# Altium project CLK.PrjPcb
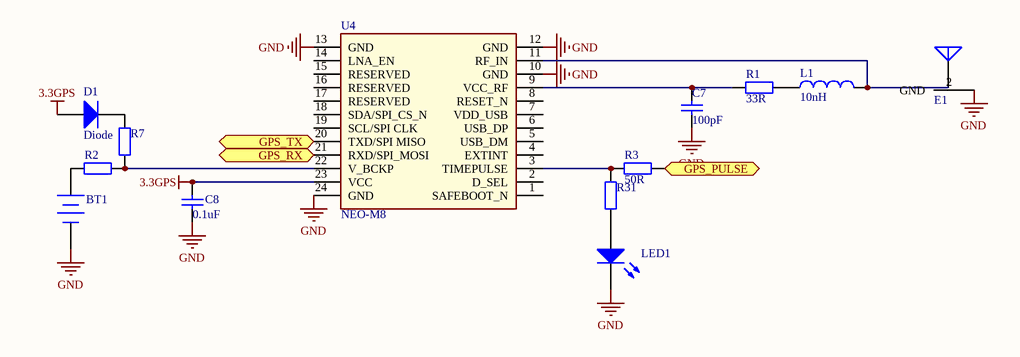
[diagram p0: GPS.SchDoc]
4 sheets, 120 parts. Net scope: flat (ports and power ports of the same name join across sheets).
Board file: CLK.PcbDoc
Sheets:
  GPS.SchDoc
  power.SchDoc
  mcu.SchDoc
  PLL1.SchDoc

## Sheet GPS.SchDoc
size A4

### Parts
BT1  Battery  [XH414H-IV01E]  (value not drawn)
C7  100pF  [0402]
C8  0.1uF  [0402]
D1  Diode  [LC-SOD-323]
E1  Antenna  [IPEX]  (value not drawn)
L1  10nH  [0402]
LED1  LED0  [0603]  (value not drawn)
R1  33R  [0402]
R2  (no value)  [0402]
R3  50R  [0402]
R7  (no value)  [0402]
R31  (no value)  [0402]
U4  NEO-M8  [NEO]

### Ports
GPS_PULSE, GPS_RX, GPS_TX

### Nets
3.3GPS: C8.2 D1.1(A) U4.23(VCC)
GND: BT1.2(-) C7.1 C8.1 E1.2(GND) LED1.2(K) U4.10(GND) U4.12(GND) U4.13(GND) U4.24(GND)
NetBT1_1: BT1.1(+) R2.1
NetC7_2: C7.2 R1.1 U4.9(VCC_RF)
NetC19_1: R3.1 ; port GPS_PULSE
NetD1_2: D1.2(K) R7.1
NetE1_1: E1.1(ANT) L1.2 U4.11(RF_IN)
NetL1_1: L1.1 R1.2
NetLED1_1: LED1.1(A) R31.2
NetR2_2: R2.2 R7.2 U4.22(V_BCKP)
NetR3_2: R3.2 R31.1 U4.3(TIMEPULSE)
NetU2_30: U4.20(TXD/SPI_MISO) ; port GPS_TX
NetU2_31: U4.21(RXD/SPI_MOSI) ; port GPS_RX

Not connected (* = marked no-connect by the designer): U4 1(SAFEBOOT_N) 2(D_SEL) 4(EXTINT) 5(USB_DM) 6(USB_DP) 7(VDD_USB) 8(RESET_N) 14(LNA_EN) 15(RESERVED) 16(RESERVED) 17(RESERVED) 18(SDA/SPI_CS_N) 19(SCL/SPI_CLK)

### Library data of the parts
BT1 = Battery: Multicell Battery; Published: 24-Mar-1999; LatestRevisionDate: 17-Jul-2002; LatestRevisionNote: Re-released for DXP Platform.; PackageReference: BAT-2; Publisher: Altium Limited; PackageDescription: Battery; 2 Leads
C7 C8 = Cap: Capacitor; Published: 8-Jun-2000; LatestRevisionDate: 17-Jul-2002; LatestRevisionNote: Re-released for DXP Platform.; PackageReference: RAD-0.3; Publisher: Altium Limited; PackageDescription: Radial Cap, Thru-Hole; 2 Leads; 0.3 in Pin Spacing
D1 = Diode: Default Diode; Published: 8-Jun-2000; LatestRevisionDate: 17-Jul-2002; LatestRevisionNote: Re-released for DXP Platform.; PackageVersion: Sep-1996; PackageReference: SMC; Publisher: Altium Limited; PackageDescription: DO-214-AB/SMC; 2 C-Bend Leads; Body 7.9 x 5.9 mm, inc. leads (LxW); Code_JEDEC: DO-214-AB
E1 = Antenna: Generic Antenna; Published: 24-Mar-1999; LatestRevisionDate: 17-Jul-2002; LatestRevisionNote: Re-released for DXP Platform.; PackageReference: PIN1; Publisher: Altium Limited
L1 = Inductor: Code_IEC: 1005; Value: 10mH; Published: 8-Jun-2000; LatestRevisionDate: 29-May-2009; LatestRevisionNote: IPC-7351 Footprint Added.; PackageReference: 0402-A; Publisher: Altium Limited; PackageDescription: Chip Inductor; Code_JEITA: 0402
LED1 = LED0: Typical INFRARED GaAs LED; Published: 8-Jun-2000; LatestRevisionDate: 08-Jul-2005; LatestRevisionNote: Mech Layer 1 removed.; PackageReference: LED-0; Publisher: Altium Limited; PackageDescription: LED; 2 Leads
R1 R3 = Res2: Resistor; Published: 8-Jun-2000; LatestRevisionDate: 17-Jul-2002; LatestRevisionNote: Re-released for DXP Platform.; PackageReference: AXIAL-0.4; Publisher: Altium Limited; PackageDescription: Axial Device, Thru-Hole; 2 Leads; 0.4 in Pin Spacing
R2 R7 R31 = Res2: Resistor; Value: 0R; Published: 8-Jun-2000; LatestRevisionDate: 17-Jul-2002; LatestRevisionNote: Re-released for DXP Platform.; PackageReference: AXIAL-0.4; Publisher: Altium Limited; PackageDescription: Axial Device, Thru-Hole; 2 Leads; 0.4 in Pin Spacing
U4 = NEO: u-blox NEO GNSS module; Part Description: u-blox GNSS module; Manufacturer: u-blox; Value: NEO-M8

## Sheet power.SchDoc
size A4
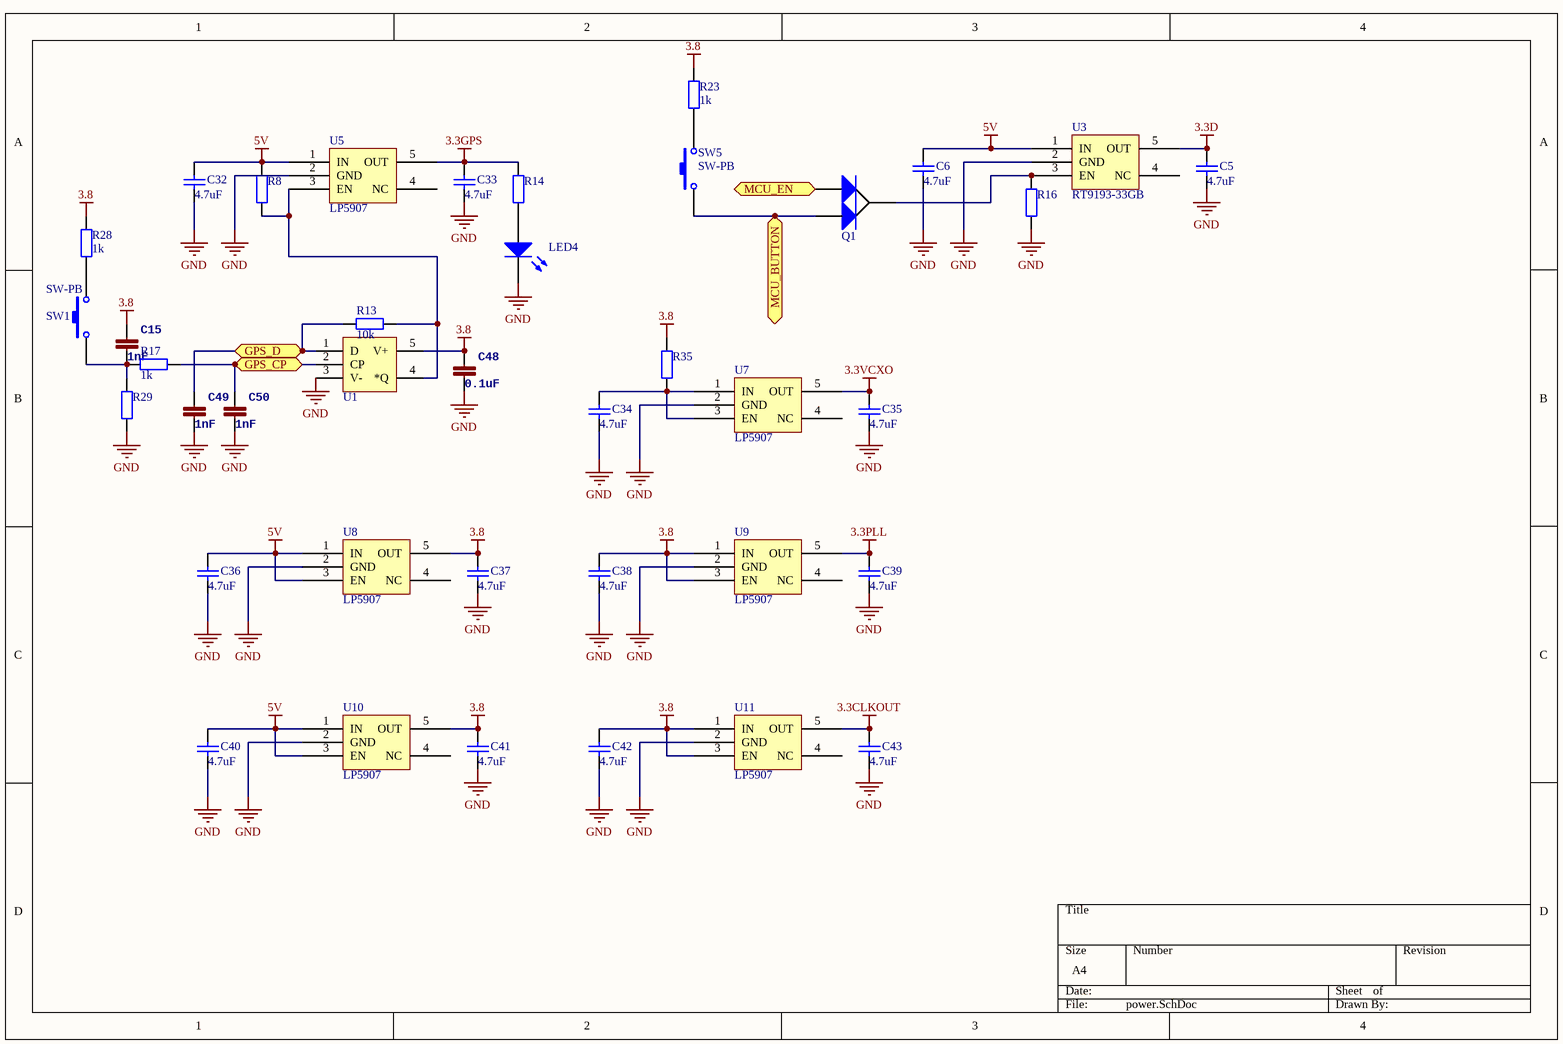
[diagram p1: power.SchDoc]

### Parts
C5  4.7uF  [0603L]
C6  4.7uF  [0603L]
C15  1nF  [0402]
C32  4.7uF  [0603L]
C33  4.7uF  [0603L]
C34  4.7uF  [0603L]
C35  4.7uF  [0603L]
C36  4.7uF  [0603L]
C37  4.7uF  [0603L]
C38  4.7uF  [0603L]
C39  4.7uF  [0603L]
C40  4.7uF  [0603L]
C41  4.7uF  [0603L]
C42  4.7uF  [0603L]
C43  4.7uF  [0603L]
C48  0.1uF  [0402]
C49  1nF  [0402]
C50  1nF  [0402]
LED4  LED0  [0603L]  (value not drawn)
Q1  BAT54C  [SOT-23B_L]  (value not drawn)
R8  (no value)  [0402]
R13  10k  [0402]
R14  (no value)  [0402]
R16  (no value)  [0402]
R17  1k  [0402]
R23  1k  [0402]
R28  1k  [0402]
R29  (no value)  [0402]
R35  (no value)  [0603L]
SW1  SW-PB  [SW3x4]
SW5  SW-PB  [SW3x4]
U1  74-1G80  [SOT23-5]  (value not drawn)
U3  RT9193-33GB  [SOT23-5]
U5  LP5907  [SOT23-5]
U7  LP5907  [SOT23-5]
U8  LP5907  [SOT23-5]
U9  LP5907  [SOT23-5]
U10  LP5907  [SOT23-5]
U11  LP5907  [SOT23-5]

### Ports
GPS_CP, GPS_D, MCU_BUTTON, MCU_EN

### Nets
3.3CLKOUT: C43.2 U11.5(OUT)
3.3D: C5.2 U3.5(OUT)
3.3GPS: C33.2 R14.1 U5.5(OUT)
3.3PLL: C39.2 U9.5(OUT)
3.3VCXO: C35.2 U7.5(OUT)
3.8: C15.1 C37.2 C38.2 C41.2 C42.2 C48.1 R23.2 R28.2 R35.1 U1.5(V+) U8.5(OUT) U9.1(IN) U9.3(EN) U10.5(OUT) U11.1(IN) U11.3(EN)
5V: C6.2 C32.2 C36.2 C40.2 R8.1 U3.1(IN) U5.1(IN) U8.1(IN) U8.3(EN) U10.1(IN) U10.3(EN)
GND: C5.1 C6.1 C32.1 C33.1 C34.1 C35.1 C36.1 C37.1 C38.1 C39.1 C40.1 C41.1 C42.1 C43.1 C48.2 C49.2 C50.2 LED4.2(K) R16.2 R29.1 U1.3(V-) U3.2(GND) U5.2(GND) U7.2(GND) U8.2(GND) U9.2(GND) U10.2(GND) U11.2(GND)
NetC15_2: C15.2 R17.2 R29.2 SW1.1
NetC34_2: C34.2 R35.2 U7.1(IN) U7.3(EN)
NetC49_1: C49.1 R13.1 U1.1(D) ; port GPS_D
NetC50_1: C50.1 R17.1 U1.2(CP) ; port GPS_CP
NetLED4_1: LED4.1(A) R14.2
NetQ1_1: Q1.1(A) ; port MCU_EN
NetQ1_2: Q1.2(A) SW5.1 ; port MCU_BUTTON
NetQ1_3: Q1.3(K) R16.1 U3.3(EN)
NetR8_2: R8.2 R13.2 U1.4(*Q) U5.3(EN)
NetR23_1: R23.1 SW5.2
NetR28_1: R28.1 SW1.2

Not connected (* = marked no-connect by the designer): U3 4(NC); U5 4(NC); U7 4(NC); U8 4(NC); U9 4(NC); U10 4(NC); U11 4(NC)

### Library data of the parts
C5 C6 C32-C43 = Cap: Capacitor; Published: 8-Jun-2000; LatestRevisionDate: 17-Jul-2002; LatestRevisionNote: Re-released for DXP Platform.; PackageReference: RAD-0.3; Publisher: Altium Limited; PackageDescription: Radial Cap, Thru-Hole; 2 Leads; 0.3 in Pin Spacing
C15 C48-C50 = CAP0402-CAP: <b>Capacitor</b> / Standard 0603 ceramic capacitor, and 0.1" leaded capacitor.; PARTNO: CC0402ZRY5V7BB104
LED4 = LED0: Typical INFRARED GaAs LED; Published: 8-Jun-2000; LatestRevisionDate: 08-Jul-2005; LatestRevisionNote: Mech Layer 1 removed.; PackageReference: LED-0; Publisher: Altium Limited; PackageDescription: LED; 2 Leads
R8 R14 R16 R29 R35 = Res2: Resistor; Value: 0R; Published: 8-Jun-2000; LatestRevisionDate: 17-Jul-2002; LatestRevisionNote: Re-released for DXP Platform.; PackageReference: AXIAL-0.4; Publisher: Altium Limited; PackageDescription: Axial Device, Thru-Hole; 2 Leads; 0.4 in Pin Spacing
R13 = Res2: Resistor; Value: 47k; Published: 8-Jun-2000; LatestRevisionDate: 17-Jul-2002; LatestRevisionNote: Re-released for DXP Platform.; PackageReference: AXIAL-0.4; Publisher: Altium Limited; PackageDescription: Axial Device, Thru-Hole; 2 Leads; 0.4 in Pin Spacing
R17 = Res2: Resistor; Published: 8-Jun-2000; LatestRevisionDate: 17-Jul-2002; LatestRevisionNote: Re-released for DXP Platform.; PackageReference: AXIAL-0.4; Publisher: Altium Limited; PackageDescription: Axial Device, Thru-Hole; 2 Leads; 0.4 in Pin Spacing
R23 R28 = Res2: Resistor; Value: 0Ohm; Published: 8-Jun-2000; LatestRevisionDate: 17-Jul-2002; LatestRevisionNote: Re-released for DXP Platform.; PackageReference: AXIAL-0.4; Publisher: Altium Limited; PackageDescription: Axial Device, Thru-Hole; 2 Leads; 0.4 in Pin Spacing
SW1 SW5 = SW-PB: Switch; Published: 24-Mar-1999; LatestRevisionDate: 17-Jul-2002; LatestRevisionNote: Re-released for DXP Platform.; PackageReference: SPST-2; Publisher: Altium Limited; PackageDescription: Switch; 2 Leads
U3 = LP5907

## Sheet mcu.SchDoc
size A4
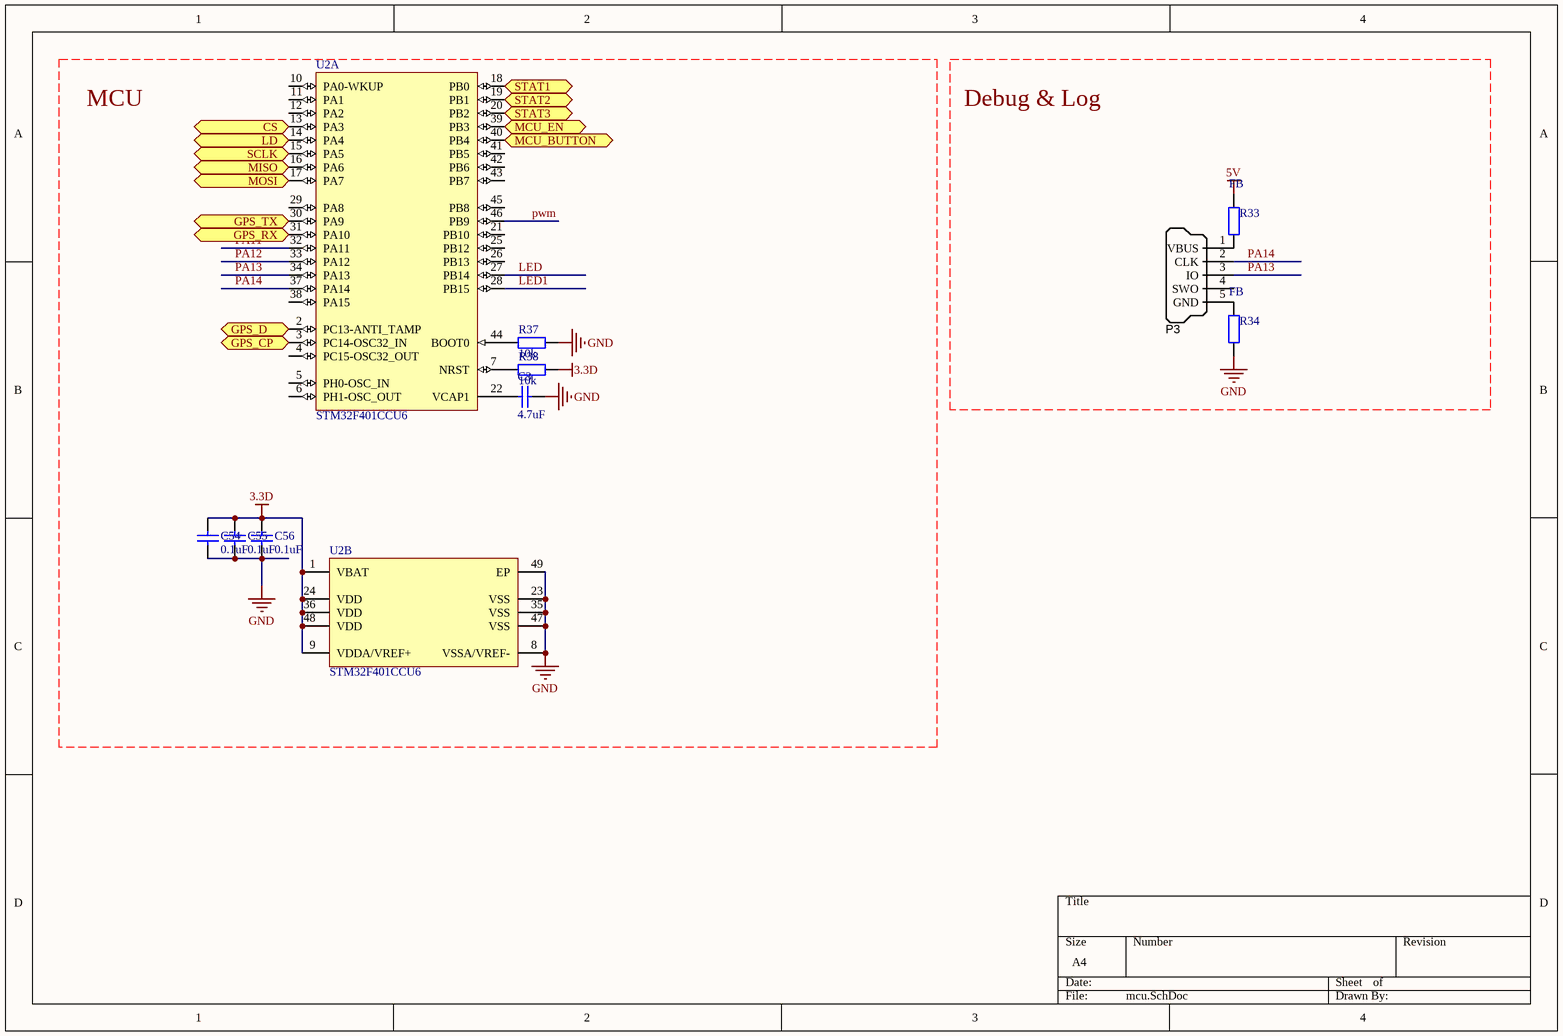
[diagram p2: mcu.SchDoc]

### Parts
C3  value 4.7uF  [0603]  (hidden comment: Cap)
C54  value 0.1uF  [0402]  (hidden comment: Cap)
C55  value 0.1uF  [0402]  (hidden comment: Cap)
C56  value 0.1uF  [0402]  (hidden comment: Cap)
P3  SWD_MicroUSB  [MICRO-YZX]  (value not drawn)
R33  FB  [0603L]
R34  FB  [0603L]
R37  value 10k  [0402]  (hidden comment: Res2)
R38  value 10k  [0402]  (hidden comment: Res2)
U2  STM32F401CCU6  [STM-UFQFPN48_N]  (parts A,B of 2)

### Ports
CS, GPS_CP, GPS_D, GPS_RX, GPS_TX, LD, MCU_BUTTON, MCU_EN, MISO, MOSI, SCLK, STAT1, STAT2, STAT3

### Nets
3.3D: C54.2 C55.2 C56.2 R38.1 U2.1(VBAT) U2.9(VDDA/VREF+) U2.24(VDD) U2.36(VDD) U2.48(VDD)
5V: R33.2
GND: C3.1 C54.1 C55.1 C56.1 R34.1 R37.2 U2.8(VSSA/VREF-) U2.23(VSS) U2.35(VSS) U2.47(VSS) U2.49(EP)
LED: U2.27(PB14)
LED1: U2.28(PB15)
PA11: U2.32(PA11)
PA12: U2.33(PA12)
PA13: P3.3(IO) U2.34(PA13)
PA14: P3.2(CLK) U2.37(PA14)
pwm: U2.46(PB9)
NetC3_2: C3.2 U2.22(VCAP1)
NetC49_1: U2.2(PC13-ANTI_TAMP) ; port GPS_D
NetC50_1: U2.3(PC14-OSC32_IN) ; port GPS_CP
NetP3_1: P3.1(VBUS) R33.1
NetP3_5: P3.5(GND) R34.2
NetQ1_1: U2.39(PB3) ; port MCU_EN
NetQ1_2: U2.40(PB4) ; port MCU_BUTTON
NetR37_1: R37.1 U2.44(BOOT0)
NetR38_2: R38.2 U2.7(NRST)
NetU2_13: U2.13(PA3) ; port CS
NetU2_14: U2.14(PA4) ; port LD
NetU2_15: U2.15(PA5) ; port SCLK
NetU2_16: U2.16(PA6) ; port MISO
NetU2_17: U2.17(PA7) ; port MOSI
NetU2_18: U2.18(PB0) ; port STAT1
NetU2_19: U2.19(PB1) ; port STAT2
NetU2_20: U2.20(PB2) ; port STAT3
NetU2_30: U2.30(PA9) ; port GPS_TX
NetU2_31: U2.31(PA10) ; port GPS_RX

Not connected (* = marked no-connect by the designer): P3 4(SWO); U2 4(PC15-OSC32_OUT) 5(PH0-OSC_IN) 6(PH1-OSC_OUT) 10(PA0-WKUP) 11(PA1) 12(PA2) 21(PB10) 25(PB12) 26(PB13) 29(PA8) 38(PA15) 41(PB5) 42(PB6) 43(PB7) 45(PB8)

### Notes on the sheet
- MCU
- Debug & Log

### Library data of the parts
C3 C54-C56 = Cap: Capacitor; Published: 8-Jun-2000; LatestRevisionDate: 17-Jul-2002; LatestRevisionNote: Re-released for DXP Platform.; PackageReference: RAD-0.3; Publisher: Altium Limited; PackageDescription: Radial Cap, Thru-Hole; 2 Leads; 0.3 in Pin Spacing
P3 = SWD_MicroUSB: Connector SMD USB Micro Type B middle mount; Manufacturer 1: Molex Inc; SCDType: undef; Package / Case: SMD; Supplier 1: Digi-Key; Supplier Part Number 1: WM17142CT-ND
R33 R34 R37 R38 = Res2: Resistor; Published: 8-Jun-2000; LatestRevisionDate: 17-Jul-2002; LatestRevisionNote: Re-released for DXP Platform.; PackageReference: AXIAL-0.4; Publisher: Altium Limited; PackageDescription: Axial Device, Thru-Hole; 2 Leads; 0.4 in Pin Spacing
U2 = STM32F401CCU6: ARM Cortex-M4 32-bit MCU+FPU, 105 DMIPS, 256 kB Flash, 64 kB Internal RAM, 36 I/Os, 48-pin UFQFPN, -40 to 85 degC, Tray; Manufacturer: STMicroelectronics; FLASH Size (Prog) (kB): 256; I/Os (High Current): 36; Internal RAM Size (kB): 64; Operating Frequency(F) (Processor speed) (MHz): 84; Supply Voltage(Vcc) max (V): 3.6; Supply Voltage(Vcc) min (V): 1.8; DatasheetVersion: Rev. 1; PackageVersion: Rev. 1, 04/2013; PackageReference: UFQFPN48; PackageDescription: 48-Pin Ultra Thin Fine Pitch Quad Flat No-Lead, 7 x 7 x 0.6 mm Body, 0.5 mm Pitch, Exposed Pad; Supplier 1: Newark; Supplier Part Number 1: 19X6217; Supplier 2: Mouser; Supplier Part Number 2: 511-STM32F401CCU6; Core: ARM Cortex-M4; Packing: Tray; Mounting Technology: Surface Mount; PartNumber: STM32F401CCU6; ComponentLink1Description: Manufacturer URL; ComponentLink1URL: http://www.st.com/web/en/home.html; ComponentLink2Description: Datasheet; ComponentLink2URL: http://www.st.com/st-web-ui/static/active/en/resource/technical/document/data_brief/DM00071938.pdf; ComponentLink3Description: Package Specification; ComponentLink3URL: http://www.st.com/st-web-ui/static/active/en/resource/technical/document/data_brief/DM00071938.pdf

## Sheet PLL1.SchDoc
size A4
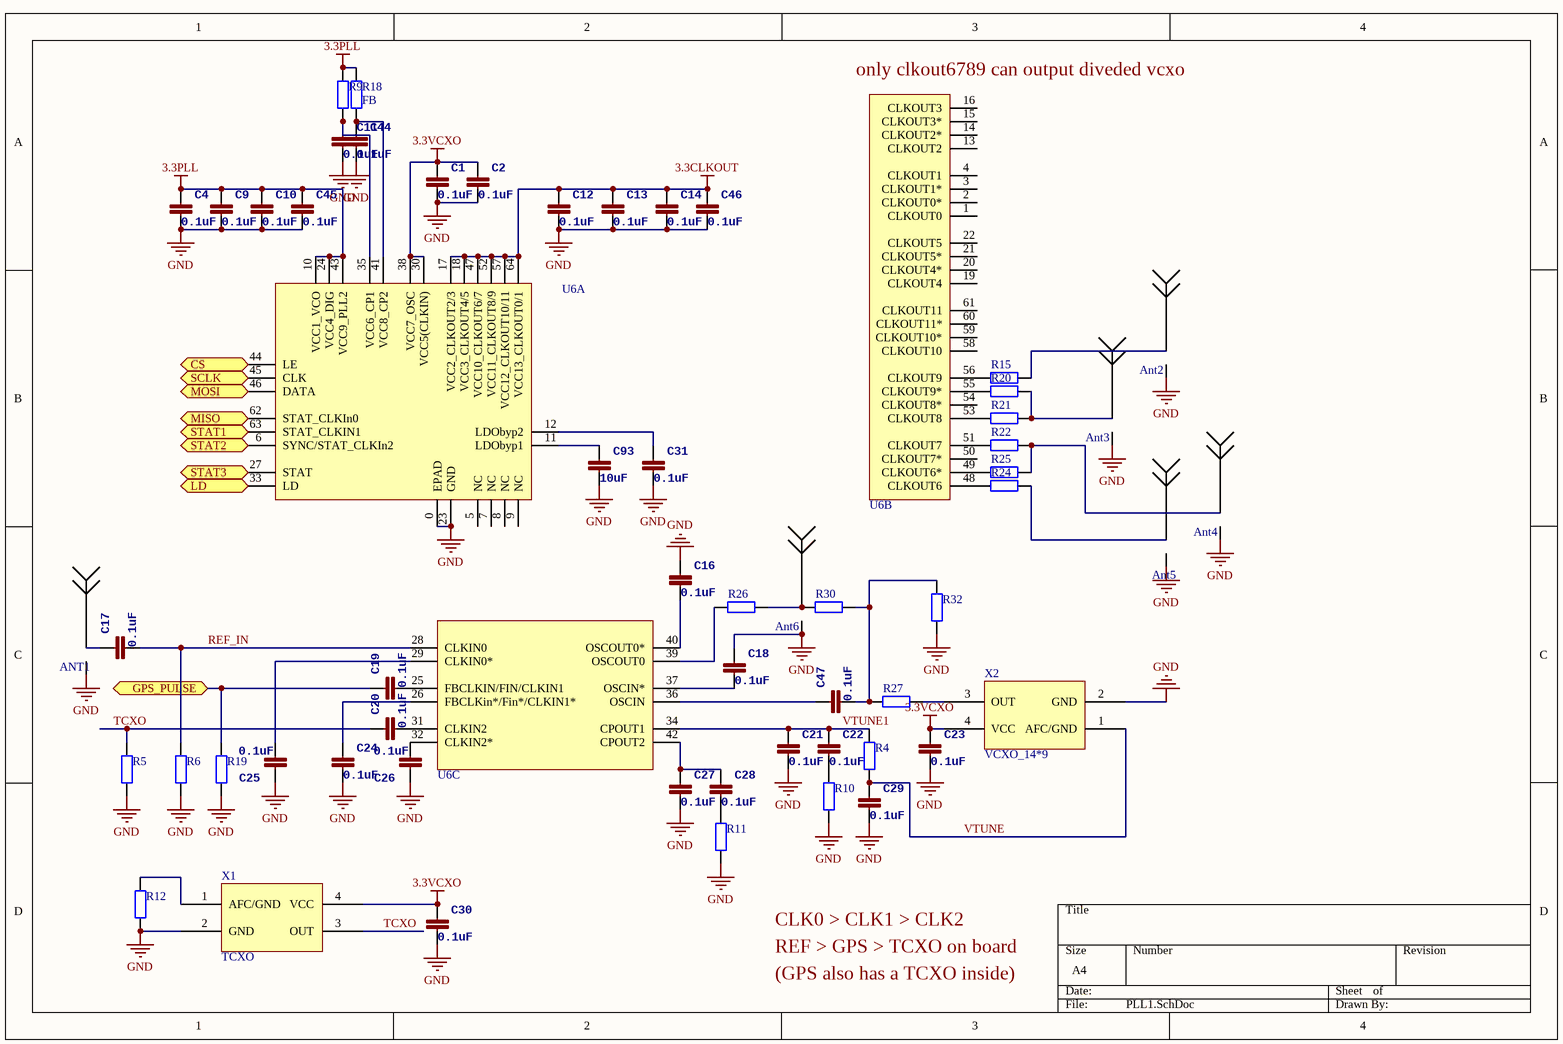
[diagram p3: PLL1.SchDoc]

### Parts
ANT1  Antenna  [SMA-2B]  (value not drawn)
Ant2  Antenna  [SMA-2B]  (value not drawn)
Ant3  Antenna  [SMA-2B]  (value not drawn)
Ant4  Antenna  [SMA-2B]  (value not drawn)
Ant5  Antenna  [SMA-2B]  (value not drawn)
Ant6  Antenna  [SMA-2B]  (value not drawn)
C1  0.1uF  [0402]
C2  0.1uF  [0402]
C4  0.1uF  [0402]
C9  0.1uF  [0402]
C10  0.1uF  [0402]
C11  0.1uF  [0402]
C12  0.1uF  [0402]
C13  0.1uF  [0402]
C14  0.1uF  [0402]
C16  0.1uF  [0402]
C17  0.1uF  [0402]
C18  0.1uF  [0402]
C19  0.1uF  [0402]
C20  0.1uF  [0402]
C21  0.1uF  [0402]
C22  0.1uF  [0402]
C23  0.1uF  [0402]
C24  0.1uF  [0402]
C25  0.1uF  [0402]
C26  0.1uF  [0402]
C27  0.1uF  [0402]
C28  0.1uF  [0402]
C29  0.1uF  [0402]
C30  0.1uF  [0402]
C31  0.1uF  [0402]
C44  0.1uF  [0402]
C45  0.1uF  [0402]
C46  0.1uF  [0402]
C47  0.1uF  [0402]
C93  10uF  [0603L]
R4  (no value)  [0402]
R5  (no value)  [0402]
R6  (no value)  [0402]
R9  (no value)  [0402]
R10  (no value)  [0402]
R11  (no value)  [0402]
R12  (no value)  [0402]
R15  (no value)  [0402]
R18  FB  [0402]
R19  (no value)  [0402]
R20  (no value)  [0402]
R21  (no value)  [0402]
R22  (no value)  [0402]
R24  (no value)  [0402]
R25  (no value)  [0402]
R26  (no value)  [0402]
R27  (no value)  [0402]
R30  (no value)  [0402]
R32  (no value)  [0402]
U6  LMK04816  [LMK04816]  (value not drawn)  (parts A,B,C of 3)
X1  TCXO  [TXC_7Q]
X2  VCXO_14*9  [CRYSTEK-9*14]

### Ports
CS, GPS_PULSE, LD, MISO, MOSI, SCLK, STAT1, STAT2, STAT3

### Nets
3.3CLKOUT: C12.1 C13.1 C14.1 C46.1 U6.17(VCC2_CLKOUT2/3) U6.18(VCC3_CLKOUT4/5) U6.47(VCC10_CLKOUT6/7) U6.52(VCC11_CLKOUT8/9) U6.57(VCC12_CLKOUT10/11) U6.64(VCC13_CLKOUT0/1)
3.3PLL: C4.1 C9.1 C10.1 C45.1 R9.2 R18.2 U6.10(VCC1_VCO) U6.24(VCC4_DIG) U6.43(VCC9_PLL2)
3.3VCXO: C1.1 C2.1 C23.1 C30.1 U6.30(VCC5(CLKIN)) U6.38(VCC7_OSC) X1.4(VCC) X2.4(VCC)
GND: ANT1.GND(G) Ant2.GND(G) Ant3.GND(G) Ant4.GND(G) Ant5.GND(G) Ant6.GND(G) C1.2 C2.2 C4.2 C9.2 C10.2 C11.2 C12.2 C13.2 C14.2 C16.1 C18.1 C21.2 C23.2 C24.2 C25.1 C26.1 C27.2 C29.2 C30.2 C31.2 C44.2 C45.2 C46.2 C93.2 R5.1 R6.2 R10.2 R11.2 R12.2 R19.1 R32.2 U6.0(EPAD) U6.23(GND) X1.2(GND) X2.2(GND)
REF_IN: C17.2 R6.1 U6.28(CLKIN0)
TCXO: C20.1 R5.2 X1.3(OUT)
VTUNE: C29.1 R4.2 X2.1(AFC/GND)
VTUNE1: C21.1 C22.1 R4.1 U6.34(CPOUT1)
NetANT1_1: ANT1.1 C17.1
NetAnt2_1: Ant2.1 R15.2
NetAnt3_1: Ant3.1 R20.2 R21.2
NetAnt4_1: Ant4.1 R22.2 R25.2
NetAnt5_1: Ant5.1 R24.2
NetAnt6_1: Ant6.1 R26.2 R30.1
NetC11_1: C11.1 R9.1 U6.35(VCC6_CP1)
NetC16_2: C16.2 U6.40(OSCOUT0*)
NetC18_2: C18.2 U6.37(OSCIN*)
NetC19_1: C19.1 R19.2 ; port GPS_PULSE
NetC19_2: C19.2 U6.25(FBCLKIN/FIN/CLKIN1)
NetC20_2: C20.2 U6.31(CLKIN2)
NetC22_2: C22.2 R10.1
NetC24_1: C24.1 U6.26(FBCLKin*/Fin*/CLKIN1*)
NetC25_2: C25.2 U6.29(CLKIN0*)
NetC26_2: C26.2 U6.32(CLKIN2*)
NetC27_1: C27.1 C28.1 U6.42(CPOUT2)
NetC28_2: C28.2 R11.1
NetC31_1: C31.1 U6.12(LDObyp2)
NetC44_1: C44.1 R18.1 U6.41(VCC8_CP2)
NetC47_1: C47.1 U6.36(OSCIN)
NetC47_2: C47.2 R27.1 R30.2 R32.1
NetC93_1: C93.1 U6.11(LDObyp1)
NetR12_1: R12.1 X1.1(AFC/GND)
NetR15_1: R15.1 U6.56(CLKOUT9)
NetR20_1: R20.1 U6.55(CLKOUT9*)
NetR21_1: R21.1 U6.53(CLKOUT8)
NetR22_1: R22.1 U6.51(CLKOUT7)
NetR24_1: R24.1 U6.48(CLKOUT6)
NetR25_1: R25.1 U6.49(CLKOUT6*)
NetR26_1: R26.1 U6.39(OSCOUT0)
NetR27_2: R27.2 X2.3(OUT)
NetU2_13: U6.44(LE) ; port CS
NetU2_14: U6.33(LD) ; port LD
NetU2_15: U6.45(CLK) ; port SCLK
NetU2_16: U6.62(STAT_CLKIn0) ; port MISO
NetU2_17: U6.46(DATA) ; port MOSI
NetU2_18: U6.63(STAT_CLKIN1) ; port STAT1
NetU2_19: U6.6(SYNC/STAT_CLKIn2) ; port STAT2
NetU2_20: U6.27(STAT) ; port STAT3

Not connected (* = marked no-connect by the designer): U6 1(CLKOUT0) 2(CLKOUT0*) 3(CLKOUT1*) 4(CLKOUT1) 5(NC) 7(NC) 8(NC) 9(NC) 13(CLKOUT2) 14(CLKOUT2*) 15(CLKOUT3*) 16(CLKOUT3) 19(CLKOUT4) 20(CLKOUT4*) 21(CLKOUT5*) 22(CLKOUT5) 50(CLKOUT7*) 54(CLKOUT8*) 58(CLKOUT10) 59(CLKOUT10*) 60(CLKOUT11*) 61(CLKOUT11)

### Notes on the sheet
- (near U6) only clkout6789 can output diveded vcxo
- CLK0 > CLK1 > CLK2
- (GPS also has a TCXO inside)
- REF > GPS > TCXO on board

### Library data of the parts
C1 C2 C4 C9-C14 C16-C31 C44-C47 C93 = CAP0402-CAP: as C15 on sheet power
R4-R6 R9-R12 R15 R19-R22 R24-R27 R30 R32 = Res2: Resistor; Value: 0R; Published: 8-Jun-2000; LatestRevisionDate: 17-Jul-2002; LatestRevisionNote: Re-released for DXP Platform.; PackageReference: AXIAL-0.4; Publisher: Altium Limited; PackageDescription: Axial Device, Thru-Hole; 2 Leads; 0.4 in Pin Spacing
R18 = Res2: Resistor; Published: 8-Jun-2000; LatestRevisionDate: 17-Jul-2002; LatestRevisionNote: Re-released for DXP Platform.; PackageReference: AXIAL-0.4; Publisher: Altium Limited; PackageDescription: Axial Device, Thru-Hole; 2 Leads; 0.4 in Pin Spacing
X1 X2 = OSC_40M

## Nets that join several sheets
3.3CLKOUT: power (C43.2 U11.5), PLL1 (10 pins)
3.3D: power (C5.2 U3.5), mcu (9 pins)
3.3GPS: GPS (C8.2 D1.1 U4.23), power (C33.2 R14.1 U5.5)
3.3PLL: power (C39.2 U9.5), PLL1 (9 pins)
3.3VCXO: power (C35.2 U7.5), PLL1 (8 pins)
5V: power (11 pins), mcu (R33.2)
GND: GPS (9 pins), power (28 pins), mcu (11 pins), PLL1 (41 pins)
NetC19_1: GPS (R3.1), PLL1 (C19.1 R19.2)
NetC49_1: power (C49.1 R13.1 U1.1), mcu (U2.2)
NetC50_1: power (C50.1 R17.1 U1.2), mcu (U2.3)
NetQ1_1: power (Q1.1), mcu (U2.39)
NetQ1_2: power (Q1.2 SW5.1), mcu (U2.40)
NetU2_13: mcu (U2.13), PLL1 (U6.44)
NetU2_14: mcu (U2.14), PLL1 (U6.33)
NetU2_15: mcu (U2.15), PLL1 (U6.45)
NetU2_16: mcu (U2.16), PLL1 (U6.62)
NetU2_17: mcu (U2.17), PLL1 (U6.46)
NetU2_18: mcu (U2.18), PLL1 (U6.63)
NetU2_19: mcu (U2.19), PLL1 (U6.6)
NetU2_20: mcu (U2.20), PLL1 (U6.27)
NetU2_30: GPS (U4.20), mcu (U2.30)
NetU2_31: GPS (U4.21), mcu (U2.31)